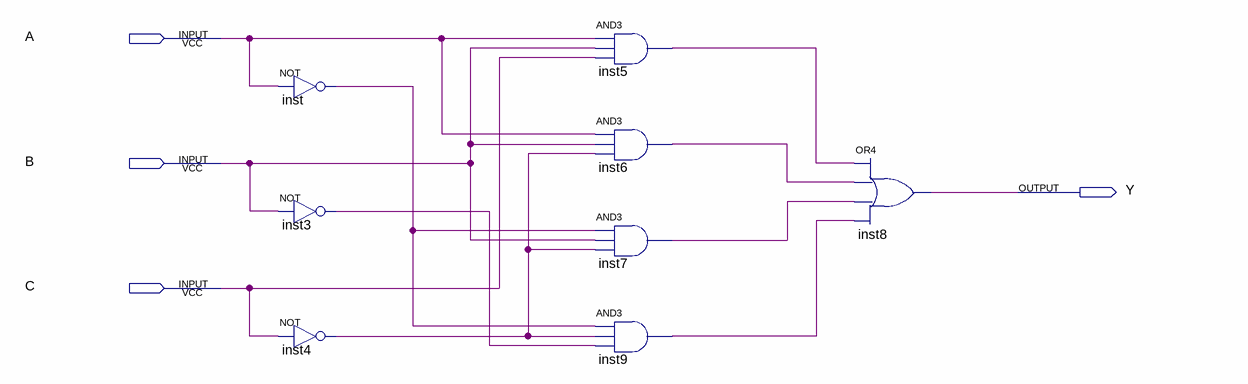
[diagram p0: schematic sheet]
// Quartus schematic circuitoFigura3.bdf as structural Verilog: 8 symbols, 4 pins
module circuitoFigura3 (
  input  A,
  input  B,
  input  C,
  output Y
);

  wire inst3_out, inst4_out, inst5_out, inst6_out, inst7_out, inst9_out, inst_out;

  not inst (inst_out, A);
  not inst3 (inst3_out, B);
  not inst4 (inst4_out, C);
  and inst5 (inst5_out, A, B, C);
  and inst6 (inst6_out, A, B, inst4_out);
  and inst7 (inst7_out, inst_out, B, inst4_out);
  and inst9 (inst9_out, inst_out, inst4_out, inst3_out);
  or inst8 (Y, inst5_out, inst6_out, inst7_out, inst9_out);
endmodule
